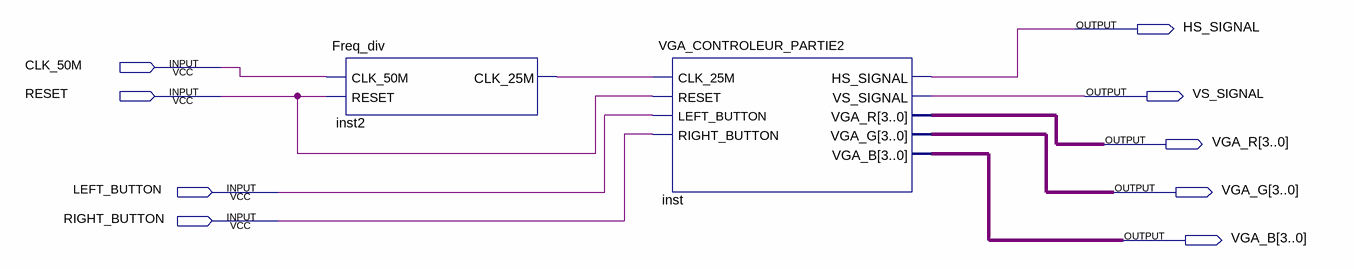
[diagram p0: schematic sheet]
// Quartus schematic VGA_BANDE_MILIEU.bdf as structural Verilog: 2 symbols, 9 pins
module VGA_BANDE_MILIEU (
  input  CLK_50M,
  input  RESET,
  input  LEFT_BUTTON,
  input  RIGHT_BUTTON,
  output HS_SIGNAL,
  output VS_SIGNAL,
  output [3:0] VGA_R,
  output [3:0] VGA_G,
  output [3:0] VGA_B
);

  wire inst2_clk_25m;

  Freq_div inst2 (.CLK_50M(CLK_50M), .RESET(RESET), .CLK_25M(inst2_clk_25m));
  VGA_CONTROLEUR_PARTIE2 inst (
    .CLK_25M(inst2_clk_25m), .RESET(RESET), .LEFT_BUTTON(LEFT_BUTTON), .RIGHT_BUTTON(RIGHT_BUTTON),
    .HS_SIGNAL(HS_SIGNAL), .VS_SIGNAL(VS_SIGNAL), .VGA_R(VGA_R), .VGA_G(VGA_G), .VGA_B(VGA_B));
endmodule
